# EAGLE design door2 (EAGLE 5.11)
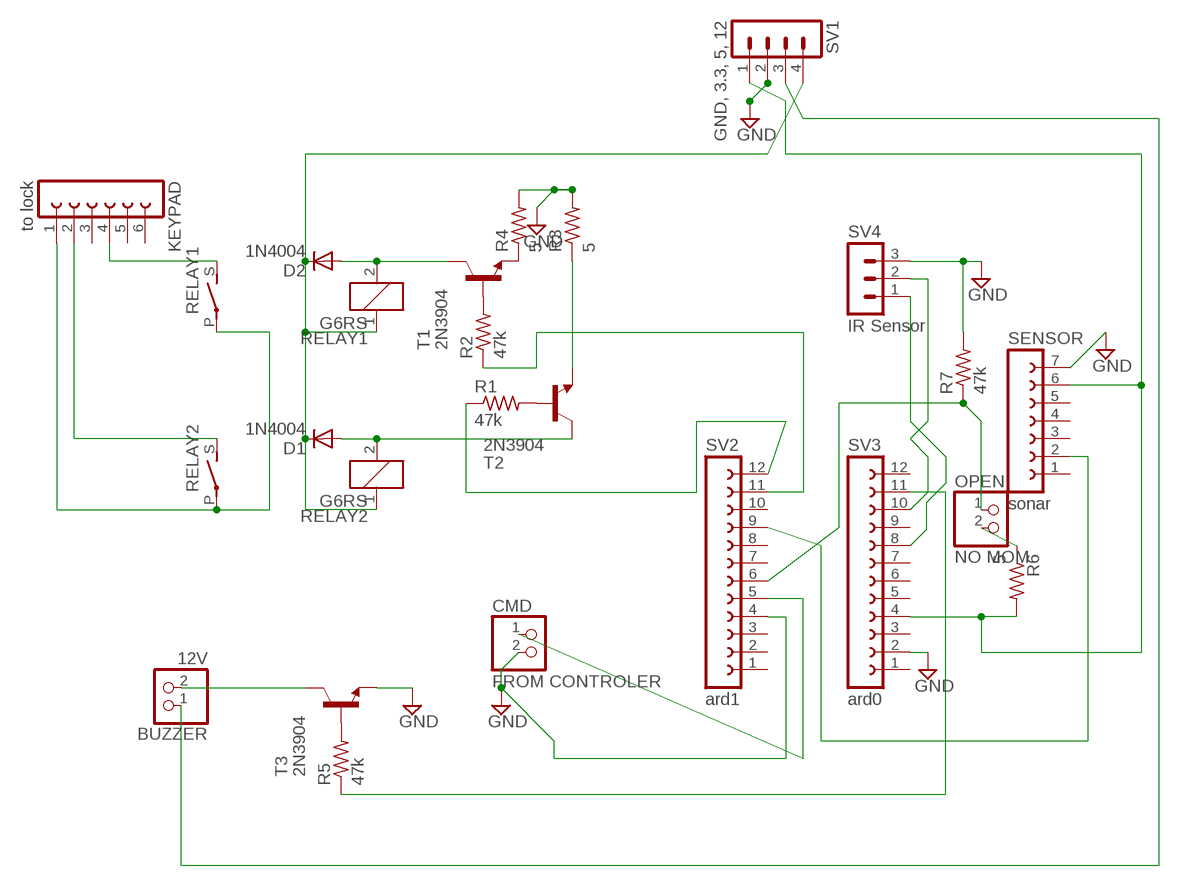
[diagram p0: schematic, sheet 1]

## Parts
BUZZER  12V  PINHD-1X2  [1X02]
CMD  FROM CONTROLER  PINHD-1X2  [1X02]
D1  1N4004  [DO41-10]
D2  1N4004  [DO41-10]
KEYPAD  to lock  FE06-1  [FE06]
OPEN  NO MOM  PINHD-1X2  [1X02]
R1  47k  R-US_0204/7  [0204/7]
R2  47k  R-US_0204/7  [0204/7]
R3  5  R-US_0204/7  [0204/7]
R4  5  R-US_0204/7  [0204/7]
R5  47k  R-US_0204/7  [0204/7]
R6  5  R-US_0204/7  [0204/7]
R7  47k  R-US_0204/7  [0204/7]
RELAY1  G6RS  [G6RS]
RELAY2  G6RS  [G6RS]
SENSOR  sonar  FE07-1  [FE07]
SV1  GND, 3.3, 5, 12  MA04-1  [MA04-1]
SV2  ard1  FE12-1  [FE12]
SV3  ard0  FE12-1  [FE12]
SV4  IR Sensor  MA03-1  [MA03-1]
T1  2N3904  [TO92]
T2  2N3904  [TO92]
T3  2N3904  [TO92]

## Nets
3.3V: R6.2 SENSOR.6 SV1.1 SV3.4
5V: D1.C D2.C RELAY1.1 RELAY2.1 SV1.4
12V: BUZZER.1 SV1.3
BZR2: BUZZER.2 T3.1(C)
GND: CMD.2 R3.2 R4.2 R7.2 SENSOR.7 SV1.2 SV2.4 SV3.2 SV4.3 T3.3(E)
K+: KEYPAD.1 RELAY1.P(2:P) RELAY2.P(2:P)
KLOCK: KEYPAD.2 RELAY2.S(2:S)
KUNLOCK: KEYPAD.4 RELAY1.S(2:S)
LOCK: R1.1 SV2.12
LOCK2: R1.2 T2.2(B)
LOCK3: D1.A RELAY2.2 T2.1(C)
LOCK4: R3.1 T2.3(E)
N$1: OPEN.1 R7.1 SV2.6
N$2: OPEN.2 R6.1
N$3: CMD.1 SV2.5
N$4: R5.1 SV3.11
N$11: SV3.8 SV4.1
N$12: SV3.10 SV4.2
N$16: R5.2 T3.2(B)
RNG: SENSOR.2 SV2.9
UNLOCK: R2.1 SV2.11
UNLOCK2: R2.2 T1.2(B)
UNLOCK3: D2.A RELAY1.2 T1.1(C)
UNLOCK4: R4.1 T1.3(E)
Unconnected: KEYPAD.3 KEYPAD.5 KEYPAD.6 SENSOR.1 SENSOR.3 SENSOR.4 SENSOR.5 SV2.1 SV2.2 SV2.3 SV2.7 SV2.8 SV2.10 SV3.1 SV3.3 SV3.5 SV3.6 SV3.7 SV3.9 SV3.12

## Library data of the parts
BUZZER CMD OPEN = pinhead:PINHD-1X2: PIN HEADER
D1 D2 = diode:1N4004: DIODE general purpose rectifier, 1 A
KEYPAD = con-lsta:FE06-1: FEMALE HEADER; OC_FARNELL: unknown; OC_NEWARK: unknown
R1-R7 = resistor:R-US_: RESISTOR, American symbol
RELAY1 RELAY2 = relay:G6RS: RELAY 1 x norm. open, Omron; OC_FARNELL: unknown; OC_NEWARK: unknown
SENSOR = con-lsta:FE07-1: FEMALE HEADER; OC_FARNELL: unknown; OC_NEWARK: unknown
SV1 = con-lstb:MA04-1: PIN HEADER; OC_FARNELL: unknown; OC_NEWARK: unknown
SV2 SV3 = con-lsta:FE12-1: FEMALE HEADER; OC_FARNELL: unknown; OC_NEWARK: unknown
SV4 = con-lstb:MA03-1: PIN HEADER; OC_FARNELL: unknown; OC_NEWARK: unknown
T1-T3 = transistor:2N3904: NPN TRANSISTOR

## Board
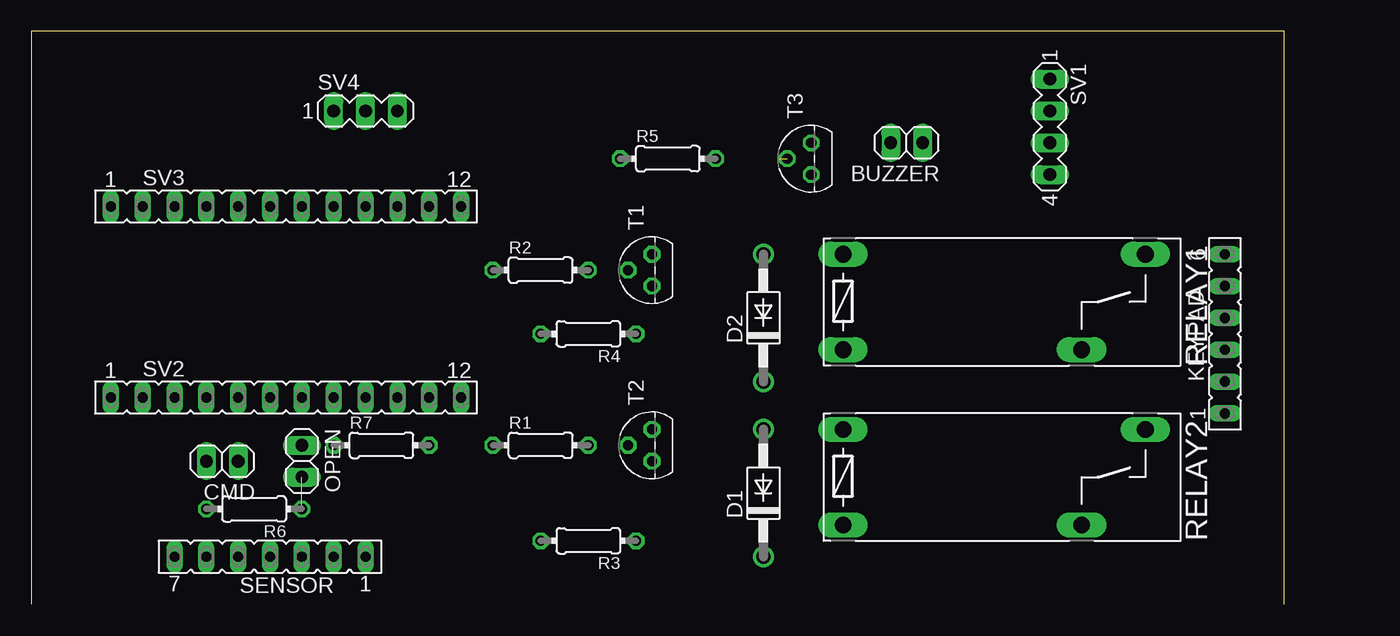
[diagram p1: board, top side]
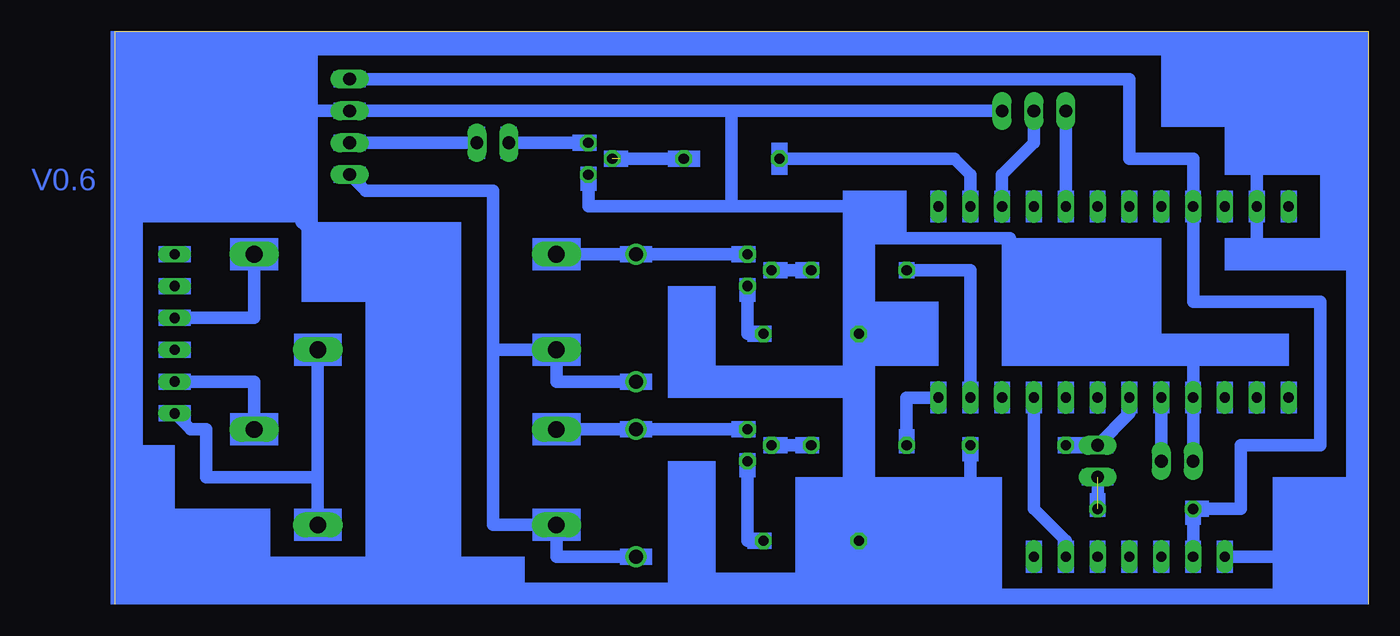
[diagram p2: board, bottom side, seen from below]

Size 100 x 45.71 mm. Coordinates in mm from the lower left corner, seen from the top.
Outline: 100,0 100,45.71 0,45.71 0,0
Copper layers (1*16): Top 0.035mm / dielectric 1.5mm / Bottom 0.035mm
Design rules "default *": minimum track width 10mil, minimum drill 24mil, track to track 8mil, track to pad 8mil, pad to pad 8mil, via to via 8mil, smd to smd 8mil, copper to edge 40mil, drill to drill 8mil, minimum pad ring 10mil, minimum via ring 8mil, stop-mask expansion 4mil, vias tented up to drill 0mil, thermal gap 10mil

### Footprints (pad centres in the part's own frame; a part is rotated, then mirrored left to right if it is on the bottom)
1X02 = drill 1.016 long: 1 -1.27,0; 2 1.27,0
DO41-10 = drill 1.118 round: A 5.08,0; C -5.08,0
FE06 = drill 0.813 long: 1 -6.35,0; 2 -3.81,0; 3 -1.27,0; 4 1.27,0; 5 3.81,0; 6 6.35,0
0204/7 = drill 0.813 octagon: 1 -3.81,0; 2 3.81,0
G6RS = drill 1.321 long: 1 -12.7,-3.81; 2 -12.7,3.81; P 6.35,-3.81; S 11.43,3.81
FE07 = drill 0.813 long: 1 -7.62,0; 2 -5.08,0; 3 -2.54,0; 4 0,0; 5 2.54,0; 6 5.08,0; 7 7.62,0
MA04-1 = drill 1.016 long: 1 -3.81,0; 2 -1.27,0; 3 1.27,0; 4 3.81,0
FE12 = drill 0.813 long: 1 -13.97,0; 2 -11.43,0; 3 -8.89,0; 4 -6.35,0; 5 -3.81,0; 6 -1.27,0; 7 1.27,0; 8 3.81,0; 9 6.35,0; 10 8.89,0; 11 11.43,0; 12 13.97,0
MA03-1 = drill 1.016 long: 1 -2.54,0; 2 0,0; 3 2.54,0
TO92 = drill 0.813 octagon: 1 1.27,0; 2 0,1.905; 3 -1.27,0

### Placement (x,y rotation side)
BUZZER  69.85,36.83 180 top
CMD  15.24,11.43 180 top
D1  58.42,8.89 90 top
D2  58.42,22.86 90 top
KEYPAD  95.25,21.59 90 top
OPEN  21.59,11.43 270 top
R1  40.64,12.7 0 top
R2  40.64,26.67 0 top
R3  44.45,5.08 180 top
R4  44.45,21.59 180 top
R5  50.8,35.56 0 top
R6  17.78,7.62 180 top
R7  27.94,12.7 0 top
RELAY1  77.47,24.13 0 top
RELAY2  77.47,10.16 0 top
SENSOR  19.05,3.81 180 top
SV1  81.28,38.1 270 top
SV2  20.32,16.51 0 top
SV3  20.32,31.75 0 top
SV4  26.67,39.37 0 top
T1  49.53,26.67 90 top
T2  49.53,12.7 90 top
T3  62.23,35.56 90 top

### Tracks (layer width: path | path; a pad name or v marks a point on that pad's centre or on a via)
3.3V
  Bottom 1.016: SV1.1 19.05,41.91 19.05,35.56 13.97,35.56 SV3.4 13.97,24.13 3.81,24.13 3.81,12.7 10.16,12.7 10.16,7.62 R6.2 SENSOR.6
5V
  Bottom 1.016: D2.C 64.77,17.78 RELAY1.1 69.85,20.32 | D1.C 64.77,3.81 RELAY2.1 69.85,6.35 69.85,20.32 | SV1.4 80.01,33.02 69.85,33.02 69.85,20.32
12V
  Bottom 1.016: BUZZER.1 SV1.3
BZR2
  Bottom 1.016: T3.1 BUZZER.2
GND
  Bottom 1.016: 50.8,39.37 SV4.3 | 85.09,39.37 85.09,30.48 77.47,24.13 73.66,20.32 73.66,1.27 40.64,1.27 R3.2 40.64,8.89 | 40.64,8.89 R4.2 40.64,29.21 | 50.8,31.75 62.23,31.75 T3.3 | SENSOR.7 1.27,3.81 1.27,27.94 8.89,27.94 SV3.2 8.89,44.45 85.09,44.45 85.09,39.37 | 85.09,39.37 SV1.2 50.8,39.37 | 50.8,39.37 50.8,31.75 | 50.8,31.75 40.64,31.75 40.64,29.21 | 40.64,29.21 28.57,29.21 28.57,20.32 13.97,20.32 SV2.4 CMD.2 | 40.64,8.89 31.75,8.89 R7.2
K+
  Bottom 1.016: KEYPAD.1 93.98,13.97 92.71,13.97 92.71,10.16 83.82,10.16 | RELAY2.P 83.82,10.16 | 83.82,10.16 RELAY1.P
KLOCK
  Bottom 1.016: RELAY2.S 88.9,17.78 KEYPAD.2
KUNLOCK
  Bottom 1.016: KEYPAD.4 88.9,22.86 RELAY1.S
LOCK
  Bottom 1.016: SV2.12 36.83,16.51 R1.1
LOCK2
  Bottom 0.406: R1.2 46.99,12.7
  Bottom 1.016: R1.2 T2.2
LOCK3
  Bottom 1.016: RELAY2.2 D1.A T2.1
LOCK4
  Bottom 1.016: T2.3 49.53,5.08 R3.1
N$1
  Bottom 0.813: SV2.6 19.05,15.24
  Bottom 1.016: R7.1 OPEN.1 19.05,15.24
N$2  (1 unrouted)
  Bottom 1.016: OPEN.2 R6.1
N$3
  Bottom 1.016: CMD.1 16.51,13.97 SV2.5
N$4
  Bottom 1.016: R5.1 33.02,35.56 31.75,34.29 SV3.11
N$11
  Bottom 1.016: SV4.1 SV3.8
N$12
  Bottom 1.016: SV4.2 26.67,36.83 29.21,34.29 SV3.10
N$16  (1 unrouted)
  Bottom 1.016: T3.2 59.69,35.56 R5.2
RNG
  Bottom 0.61: SENSOR.2 24.13,5.08
  Bottom 1.016: 24.13,5.08 26.67,7.62 SV2.9
UNLOCK
  Bottom 1.016: R2.1 31.75,26.67 SV2.11
UNLOCK2
  Bottom 1.016: R2.2 T1.2 R2.2
UNLOCK3
  Bottom 1.016: T1.1 D2.A RELAY1.2
UNLOCK4
  Bottom 1.016: R4.1 49.53,21.59 T1.3
(copper drawn outside any net)
  shapes: Bottom area x128

### Text on the board
Bottom: V0.6